# Altium project PCB_Project1.PrjPCB
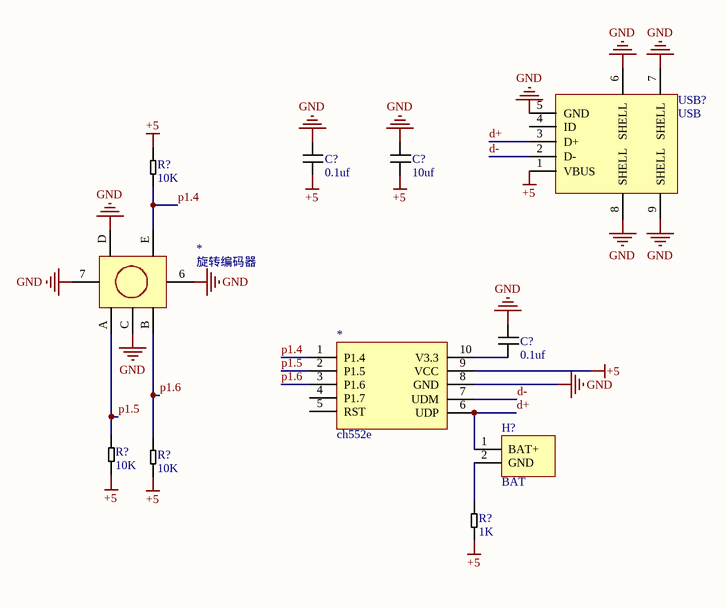
[diagram p0: Sheet1.SchDoc]
1 sheet, 11 parts. Net scope: global (net labels, ports and power ports of the same name join across sheets).
Board file: PCB1.PcbDoc

## Sheet Sheet1.SchDoc
size A3

### Parts
(Parts that share a designator on the sheet are numbered #1, #2 ... from top to bottom, then left to right.)
*  旋转编码器  [SW-TH_EC11XXXXXXXX]
C?#1  0.1uf  [0805CAP]
C?#2  10uf  [0805CAP]
C?#3  0.1uf  [0805CAP]
CH552E  ch552e  [ch552e]
H?  BAT  [BAT]
R?#1  10K  [0805R]
R?#2  10K  [0805R]
R?#3  10K  [0805R]
R?#4  1K  [0805R]
USB?  USB  [micro usb]

### Nets
+5: C?#1.1(SHELL) C?#2.1(SHELL) CH552E.9(VCC) R?#1.1 R?#2.1 R?#3.1 R?#4.1 USB?.1(VBUS)
GND: *.6 *.7 *.C *.D C?#1.2(SHELL) C?#2.2(SHELL) C?#3.2(SHELL) CH552E.8(GND) USB?.5(GND) USB?.6(SHELL) USB?.7(SHELL) USB?.8(SHELL) USB?.9(SHELL)
d+: CH552E.6(UDP) H?.1(BAT+) USB?.3(D+)
d-: CH552E.7(UDM) USB?.2(D-)
p1.4: *.E CH552E.1(P1.4) R?#1.2
p1.5: *.A CH552E.2(P1.5) R?#2.2
p1.6: *.B CH552E.3(P1.6) R?#3.2
NetC?#3_1: C?#3.1(SHELL) CH552E.10(V3.3)
NetH?_2: H?.2(GND) R?#4.2

Not connected (* = marked no-connect by the designer): CH552E 4(P1.7) 5(RST); USB? 4(ID)

### Library data of the parts
C?#1-C?#3 = CAP
R?#1-R?#4 = RES
USB? = micro_usb